# Altium schematic sheet 7_SurvBot_RCU_ExternalMemory.SchDoc
size A4; SheetNumber: 8; SheetTotal: 8
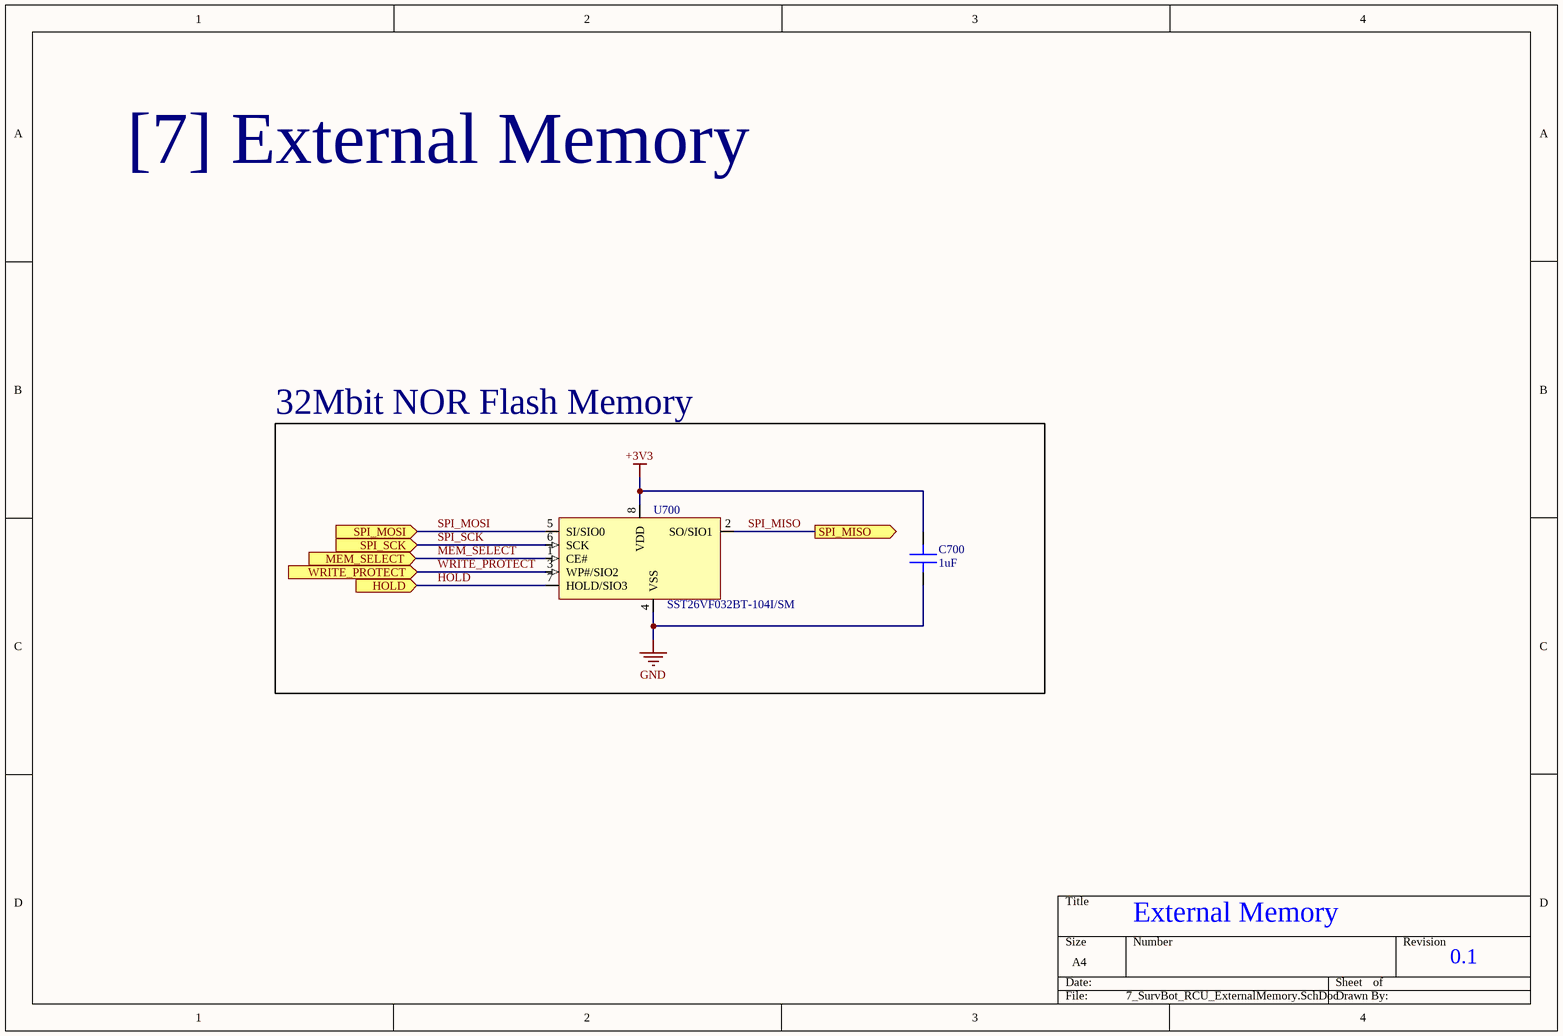
[diagram p0: 7_SurvBot_RCU_ExternalMemory.SchDoc]

## Parts
C700  1uF  [CAP_0603]
U700  SST26VF032BT-104I/SM  [8-SOIC, 5.26x5.25mm]

## Blocks framed on the sheet
32Mbit NOR Flash Memory: C700 U700

## Ports
HOLD (in, see 0_SurvBot_RCU_Overview[1B], 2_SurvBot_RCU_MCU[4A]), MEM_SELECT (in, see 0_SurvBot_RCU_Overview[1B], 2_SurvBot_RCU_MCU[4A]), SPI_MISO (out, see 0_SurvBot_RCU_Overview[1B], 2_SurvBot_RCU_MCU[4A]), SPI_MOSI (in, see 0_SurvBot_RCU_Overview[1B], 2_SurvBot_RCU_MCU[4A]), SPI_SCK (in, see 0_SurvBot_RCU_Overview[1B], 2_SurvBot_RCU_MCU[4A]), WRITE_PROTECT (in, see 0_SurvBot_RCU_Overview[1B], 2_SurvBot_RCU_MCU[4A])

## Nets
+3V3: C700.2 U700.8(VDD)
GND: C700.1 U700.4(VSS)
HOLD: U700.7(HOLD/SIO3) ; port HOLD
MEM_SELECT: U700.1(CE#) ; port MEM_SELECT
SPI_MISO: U700.2(SO/SIO1) ; port SPI_MISO
SPI_MOSI: U700.5(SI/SIO0) ; port SPI_MOSI
SPI_SCK: U700.6(SCK) ; port SPI_SCK
WRITE_PROTECT: U700.3(WP#/SIO2) ; port WRITE_PROTECT

## Notes on the sheet
- [7] External Memory
- External Memory
- 0.1

## Library data of the parts
C700 = CAP_1uF-16V-10%-0603: 1 µF ±10% 16V Ceramic Capacitor X7R 0603 (1608 Metric); Manufacturer: YAGEO; Manufacturer Part #: CC0603KRX7R7BB105; Case/Package: 0603; Supplier: JLCPCB; Supplier Part #: C106248
U700 = IC_SST26VF032BT-104I/SM: FLASH Memory IC 32Mbit SPI - Quad I/O 104 MHz 8-SOIJ; Manufacturer: Microchip Tech; Manufacturer Part #: SST26VF032BT-104I/SM; Case/Package: 8-SOIC; Supplier: JLCPCB; Supplier Part #: C69337